# EAGLE design Benchtop Power Supply-v13 (EAGLE 7.0.0)
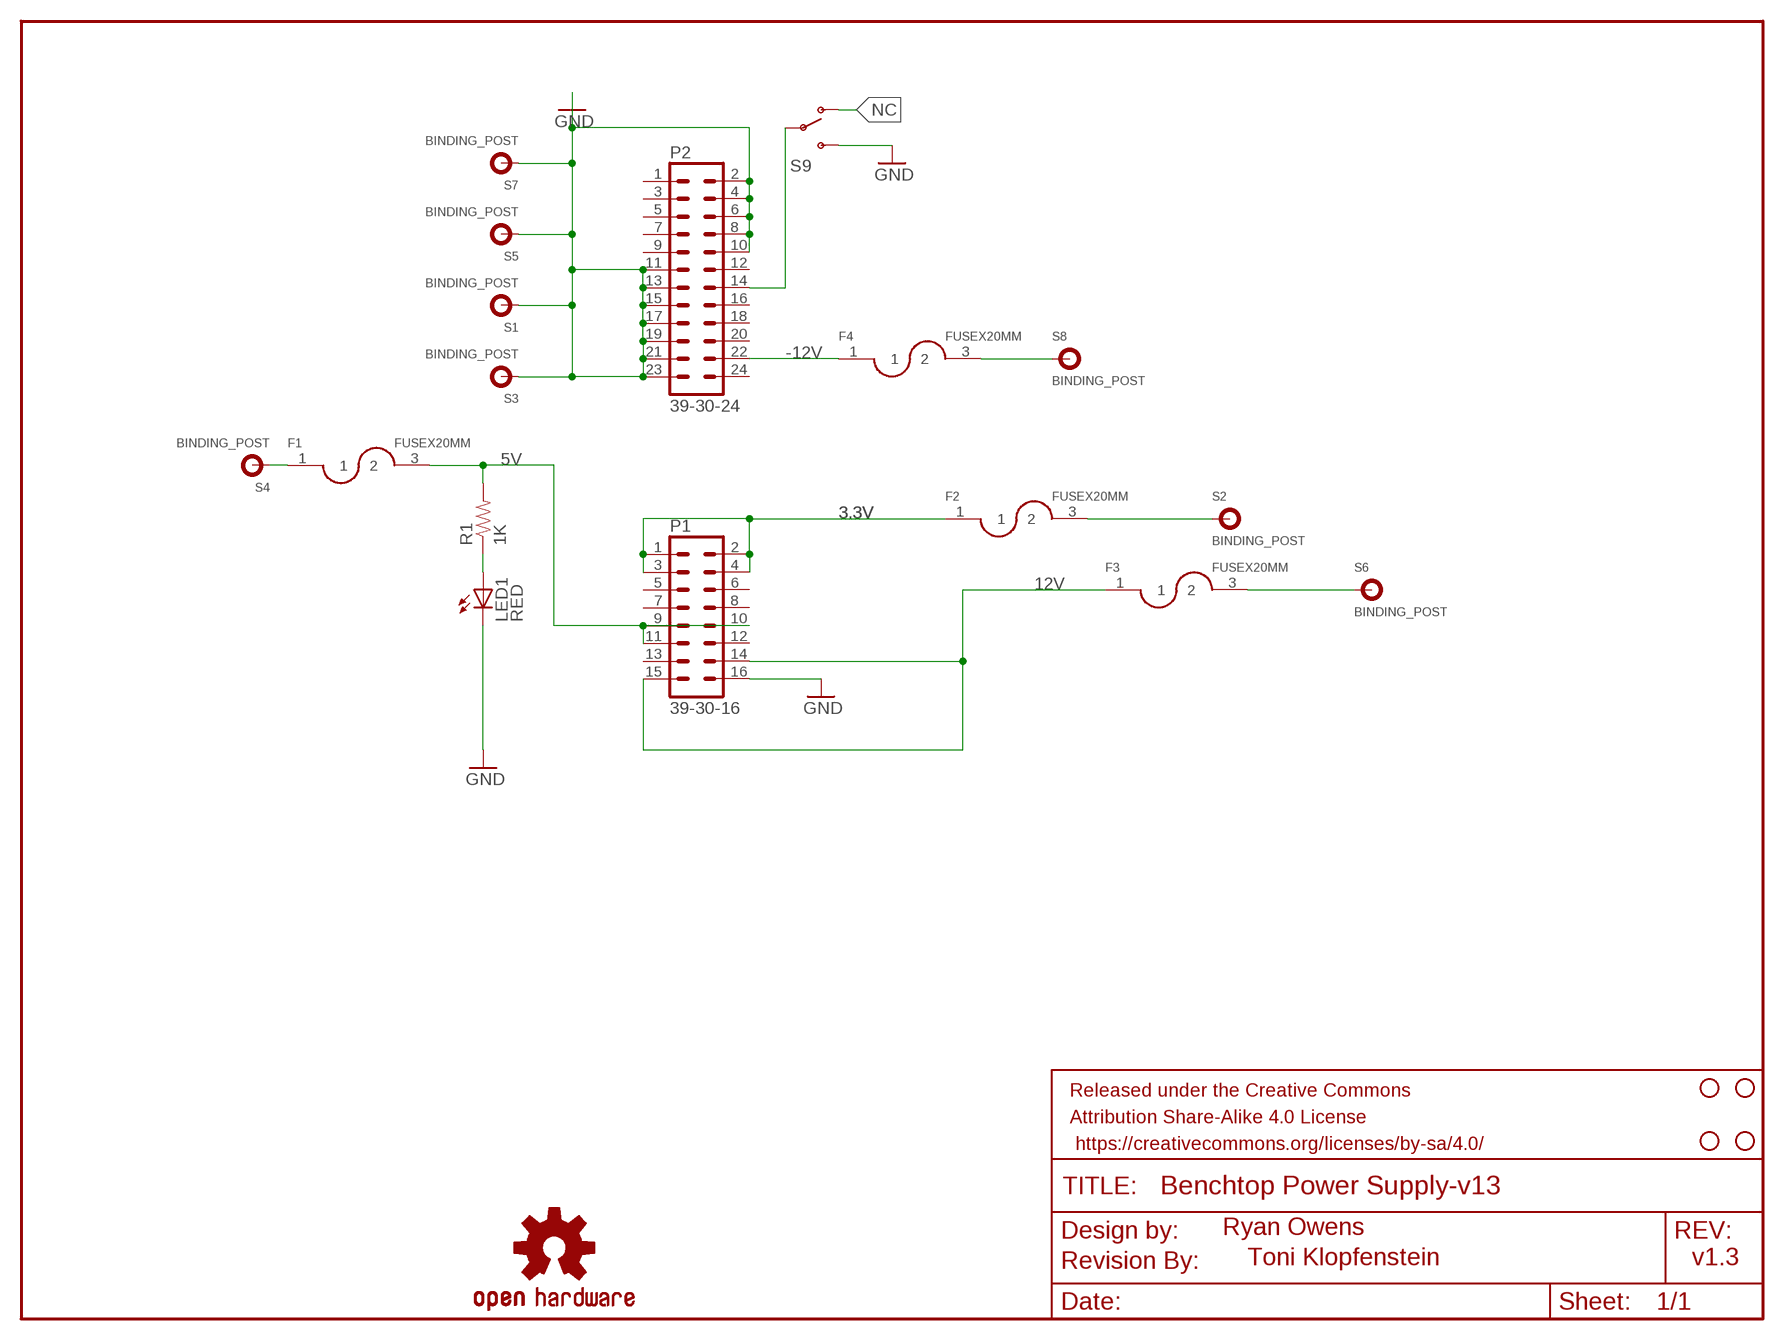
[diagram p0: schematic, sheet 1]

## Parts
F1  FUSEX20MM  [FUSE_5MM]
F2  FUSEX20MM  [FUSE_5MM]
F3  FUSEX20MM  [FUSE_5MM]
F4  FUSEX20MM  [FUSE_5MM]
FRAME1  FRAME-LETTER  [CREATIVE_COMMONS]
JP2  STAND-OFF  [STAND-OFF]
JP3  STAND-OFF  [STAND-OFF]
JP4  STAND-OFF  [STAND-OFF]
JP5  STAND-OFF  [STAND-OFF]
LED1  RED  LED5MM  [LED5MM]
LOGO1  OSHW-LOGOL  [OSHW-LOGO-L]
P1  39-30-16  [39-30-?16?]
P2  39-30-24  [39-30-?24?]
R1  1K  RESISTORPTH1  [AXIAL-0.3]
S1  BINDING_POST  [BINDING_POST]
S2  BINDING_POST  [BINDING_POST]
S3  BINDING_POST  [BINDING_POST]
S4  BINDING_POST  [BINDING_POST]
S5  BINDING_POST  [BINDING_POST]
S6  BINDING_POST  [BINDING_POST]
S7  BINDING_POST  [BINDING_POST]
S8  BINDING_POST  [BINDING_POST]
S9  SWITCH-SPDTKIT  [SWITCH-SPDT_KIT]
U$1  REVISION  [REVISION]

## Nets
3.3V: F2.1 P1.1 P1.2 P1.3 P1.4
3.3V_P: F2.3 S2.P$1
5V: F1.3 P1.9 P1.10 P1.11 R1.P$2
5V_P: F1.1 S4.P$1
12V: F3.1 P1.14 P1.15
12V_P: F3.3 S6.P$1
-12V: F4.1 P2.22
-12V_P: F4.3 S8.P$1
GND: LED1.K(C) P1.16 P2.2 P2.4 P2.6 P2.8 P2.10 P2.11 P2.13 P2.15 P2.17 P2.19 P2.21 P2.23 S1.P$1 S3.P$1 S5.P$1 S7.P$1 S9.3(S)
N$1: LED1.A R1.P$1
N$2: P2.14 S9.2(P)
NC: S9.1(O)
Unconnected: P1.5 P1.6 P1.7 P1.8 P1.12 P1.13 P2.1 P2.3 P2.5 P2.7 P2.9 P2.12 P2.16 P2.18 P2.20 P2.24

## Notes on the sheet
- Ryan Owens
- Toni Klopfenstein | v1.3

## Library data of the parts
F1-F4 = SparkFun:FUSE
FRAME1 = SparkFun-Aesthetics:FRAME-LETTER: Schematic Frame Standard 8.5x11 US Letter frame
JP2-JP5 = SparkFun-Electromechanical:STAND-OFF: #4 Stand Off This is the mechanical footprint for a #4 phillips button head screw. Use the keepout ring to avoid running the screw head into surrounding components. SKU : PRT-00447
LED1 = SparkFun:LED: LEDs Standard schematic elements and footprints for 5mm, 3mm, 1206, and 0603 sized LEDs. 5mm - Spark Fun Electronics SKU : COM-00529 (and others)
LOGO1 = SparkFun-Aesthetics:OSHW-LOGO: Open Source Hardware Logo This logo indicates the piece of hardware it is found on incorporates a OSHW license and/or adheres to the definition of open source hardware found here: http://freedomdefined.org/OSHW
P1 = con-molex-mini-fit:39-30-?16?: HEADER
P2 = con-molex-mini-fit:39-30-?24?: HEADER
R1 = SparkFun:RESISTOR: Resistor Basic schematic elements and footprints for 0603, 1206, and PTH 1/10th watt (small) resistors.
S1-S8 = SparkFun-Connectors:BINDING_POST: Single Banana jack. PRT-09739 (red) or PRT-09740 (blk) Footprint is a bit strange. The component itself has an threaded, insulated body that goes through the board, with a small threaded metal stud coming off the back. The intent of this package is that the post goes through a milled obling hole, and a small wire would be used to connect from the PCB pad to the metal contact on the post.
S9 = SparkFun-Electromechanical:SWITCH-SPDT: SPDT Switch Simple slide switch, Spark Fun Electronics SKU : COM-00102 DPDT SMT slide switch, AYZ0202, SWCH-08179; PROD_ID: SWCH-08261
U$1 = SparkFun-Aesthetics:REVISION

## Net classes
0 default: width 1.524 mm

## Board
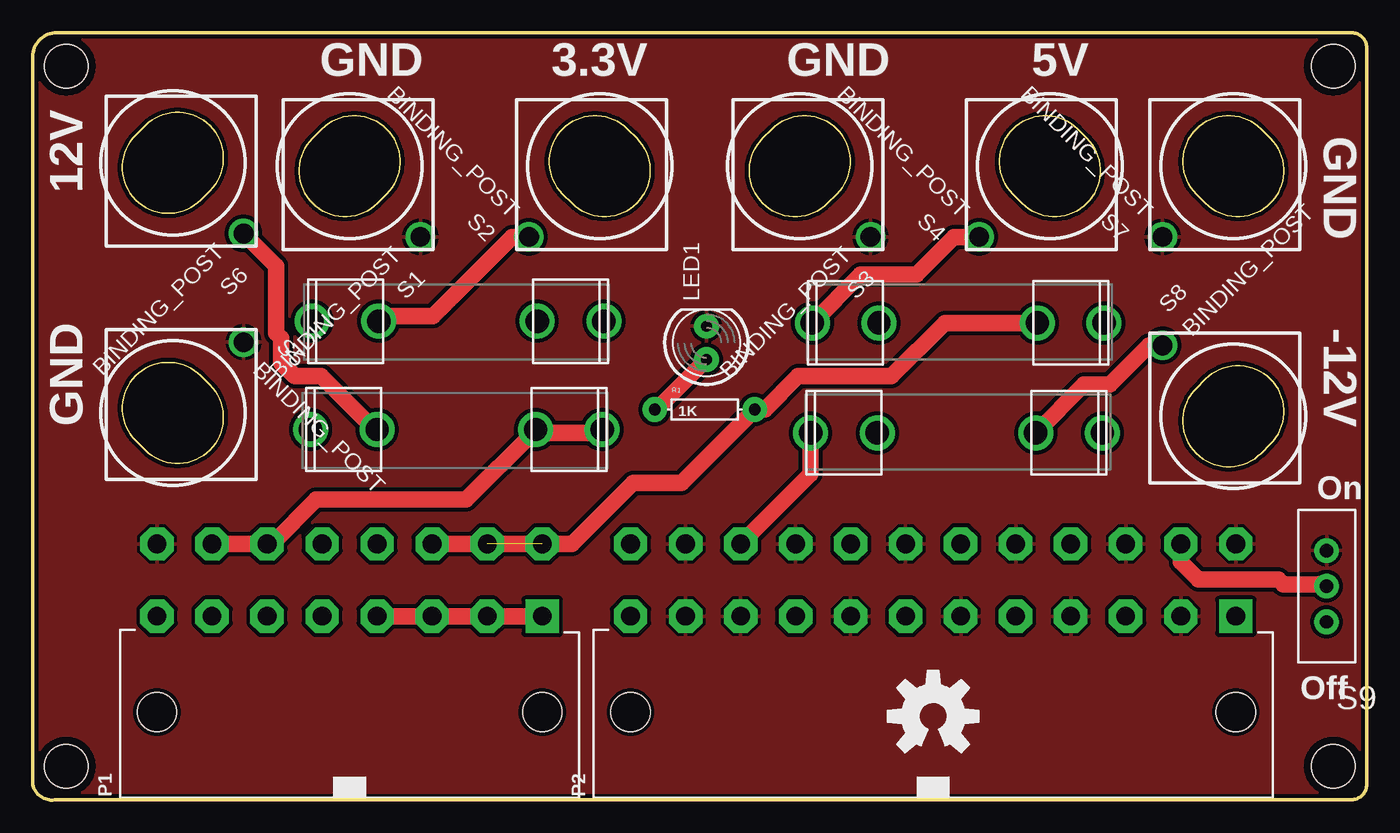
[diagram p1: board, top side]
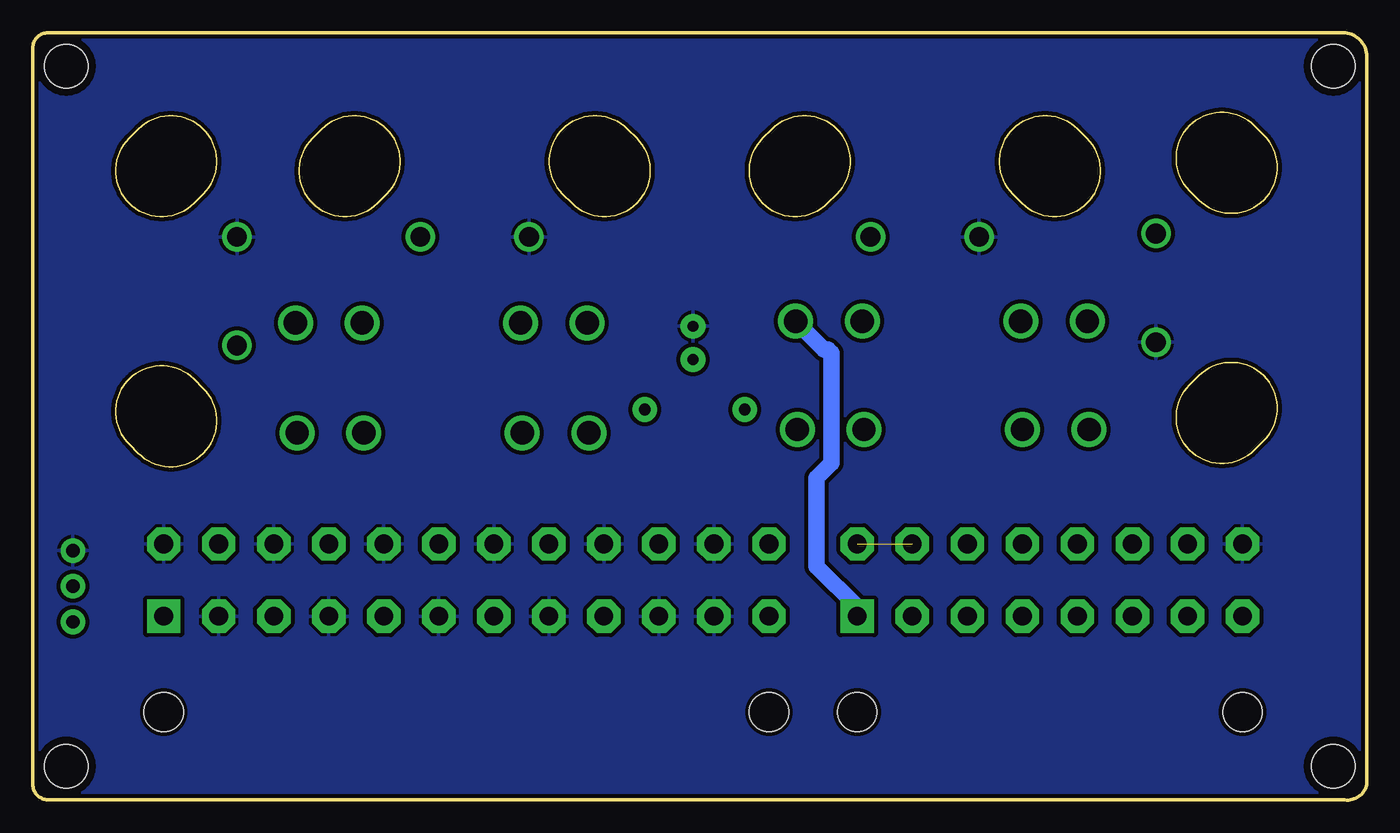
[diagram p2: board, bottom side, seen from below]

Size 101.6 x 58.45 mm. Coordinates in mm from the lower left corner, seen from the top.
Outline: 1.8,58.45 100.45,58.45 arc-90 101.6,57.31 101.6,1.18 arc-90 100.45,0.03 1.8,0.03 arc-90 0,1.18 0,56.66 arc-90 1.8,58.45
Copper layers (1*16): Top 0.035mm / dielectric 1.5mm / Bottom 0.035mm
Design rules "SparkFun-2-layer": minimum track width 7mil, minimum drill 15mil, track to track 8mil, track to pad 8mil, pad to pad 8mil, via to via 8mil, smd to smd 8mil, copper to edge 8mil, drill to drill 8mil, minimum pad ring 12mil, minimum via ring 10mil, stop-mask expansion 4mil, vias tented up to drill 20mil, thermal gap 10mil

### Footprints (pad centres in the part's own frame; a part is rotated, then mirrored left to right if it is on the bottom)
FUSE_5MM = drill 1.778: 1 0,-11.113; 2 0,-6.032; 3 0,6.032; 4 0,11.113
STAND-OFF = hole 3.302: 0,0
LED5MM = drill 0.813 pad 1.88: A -1.27,0; K 1.27,0
39-30-?16? = drill 1.422 pad 2.54 square: 1 14.668,0 | drill 1.422 pad 2.54 octagon: 2 10.477,0; 3 6.287,0; 4 2.095,0; 5 -2.095,0; 6 -6.287,0; 7 -10.477,0; 8 -14.668,0; 9 14.668,5.512; 10 10.477,5.512; 11 6.287,5.512; 12 2.095,5.512; 13 -2.095,5.512; 14 -6.287,5.512; 15 -10.477,5.512; 16 -14.668,5.512 | hole 3: -14.668,-7.3; 14.668,-7.3
39-30-?24? = drill 1.422 pad 2.54 square: 1 23.05,0 | drill 1.422 pad 2.54 octagon: 2 18.86,0; 3 14.668,0; 4 10.477,0; 5 6.287,0; 6 2.095,0; 7 -2.095,0; 8 -6.287,0; 9 -10.477,0; 10 -14.668,0; 11 -18.86,0; 12 -23.05,0; 13 23.05,5.512; 14 18.86,5.512; 15 14.668,5.512; 16 10.477,5.512; 17 6.287,5.512; 18 2.095,5.512; 19 -2.095,5.512; 20 -6.287,5.512; 21 -10.477,5.512; 22 -14.668,5.512; 23 -18.86,5.512; 24 -23.05,5.512 | hole 3: -23.05,-7.3; 23.05,-7.3
AXIAL-0.3 = drill 0.9 pad 1.88: P$1 -3.81,0; P$2 3.81,0
BINDING_POST = drill 1.5: P$1 0,7.62
SWITCH-SPDT_KIT = drill 1.016 pad 1.88: 1 0,2.718; 2 0,0; 3 0,-2.718

### Placement (x,y rotation side)
F1  70.48,36.36 270 top
F2  32.38,36.48 90 top
F3  32.26,28.23 90 top
F4  70.36,27.97 270 top
FRAME1  24.66,-30.45 0 top  (outside the outline)
JP2  99.06,2.57 0 top
JP3  99.06,55.91 0 top
JP4  2.54,2.57 0 top
JP5  2.54,55.91 0 top
LED1  51.31,34.83 90 top
LOGO1  68.58,6.38 0 top
P1  39-30-16?  [39-30-?16?]  24.13,14 0 top
P2  39-30-24?  [39-30-?24?]  68.58,14 0 top
R1  51.18,29.75 0 top
S1  24.13,48.29 225 top
S2  43.18,48.29 135 top
S3  58.42,48.29 225 top
S4  77.47,48.29 135 top
S5  10.67,29.5 315 top
S6  10.67,48.55 225 top
S7  91.44,48.29 135 top
S8  91.44,29.24 45 top
S9  98.55,16.29 180 top
U$1  35.56,-34.26 0 top  (outside the outline)

### Tracks (layer width: path | path; a pad name or v marks a point on that pad's centre or on a via)
3.3V
  Top 1.27: P1.4 P1.3 P1.2 P1.1
  Bottom 1.27: P1.1 38.8,14.7 41.91,17.81 41.91,24.55 40.77,25.69 40.77,34.07 41.02,34.32 41.34,34.32 F2.1
3.3V_P
  Top 1.27: S2.P$1 36.52,42.91 30.48,36.86 26.73,36.86 F2.3
5V  (1 unrouted)
  Top 1.27: P1.11 P1.9 41.07,19.52 45.72,24.16 49.4,24.16 R1.P$2 55.75,29.75 58.29,32.29 65.41,32.29 69.47,36.36 F1.3
5V_P
  Top 1.27: S4.P$1 70.18,42.91 67.31,40.04 63.06,40.04 F1.1
12V
  Top 1.27: P1.15 P1.14 18.21,19.52 21.59,22.89 33.02,22.89 38.1,27.97 43.12,27.97 F3.1
12V_P
  Top 1.27: F3.3 26.04,28.23 21.97,32.29 19.94,32.29 18.92,33.31 18.92,35.21 18.54,35.59 18.54,40.67 S6.P$1
-12V
  Top 1.27: F4.1 59.24,24.85 P2.22
-12V_P
  Top 1.27: S8.P$1 85.02,34.63 82.04,31.66 80.07,31.66 F4.3
GND
  pour Bottom (isolate 0.305): 0,0.03 0,58.45 101.6,58.45 101.6,0.03
  pour Top (isolate 0.305): 0,0.03 0,58.45 101.6,58.45 101.6,0.03
N$1
  Top 1.27: R1.P$1 47.5,29.75 LED1.A
N$2
  Top 1.27: P2.14 87.44,18.13 88.77,16.8 94.87,16.8 95.25,16.42 98.42,16.42 S9.2

### Text on the board
tPlace: GND | 3.3V | GND | 5V | GND | 12V | -12V | GND | On | Off
tDocu: ROUTE / OUT | ROUTE / OUT | ROUTE / OUT | ROUTE / OUT | ROUTE / OUT | ROUTE / OUT | ROUTE / OUT | ROUTE / OUT | Ryan Owens | Toni Klopfenstein